# EasyEDA Pro project compute-module-v101.eprj, schematic adc-frontend-dif
Board Name: mod-dif-adc-frontend; Create Date: 2025-09-19; Page Name: P1; Project Name: compute-module-v101; Schematic Name: adc-frontend-dif; Update Date: 2025-12-03; Company: EasyEDA.com; Page Size: A4; Version: V1.0
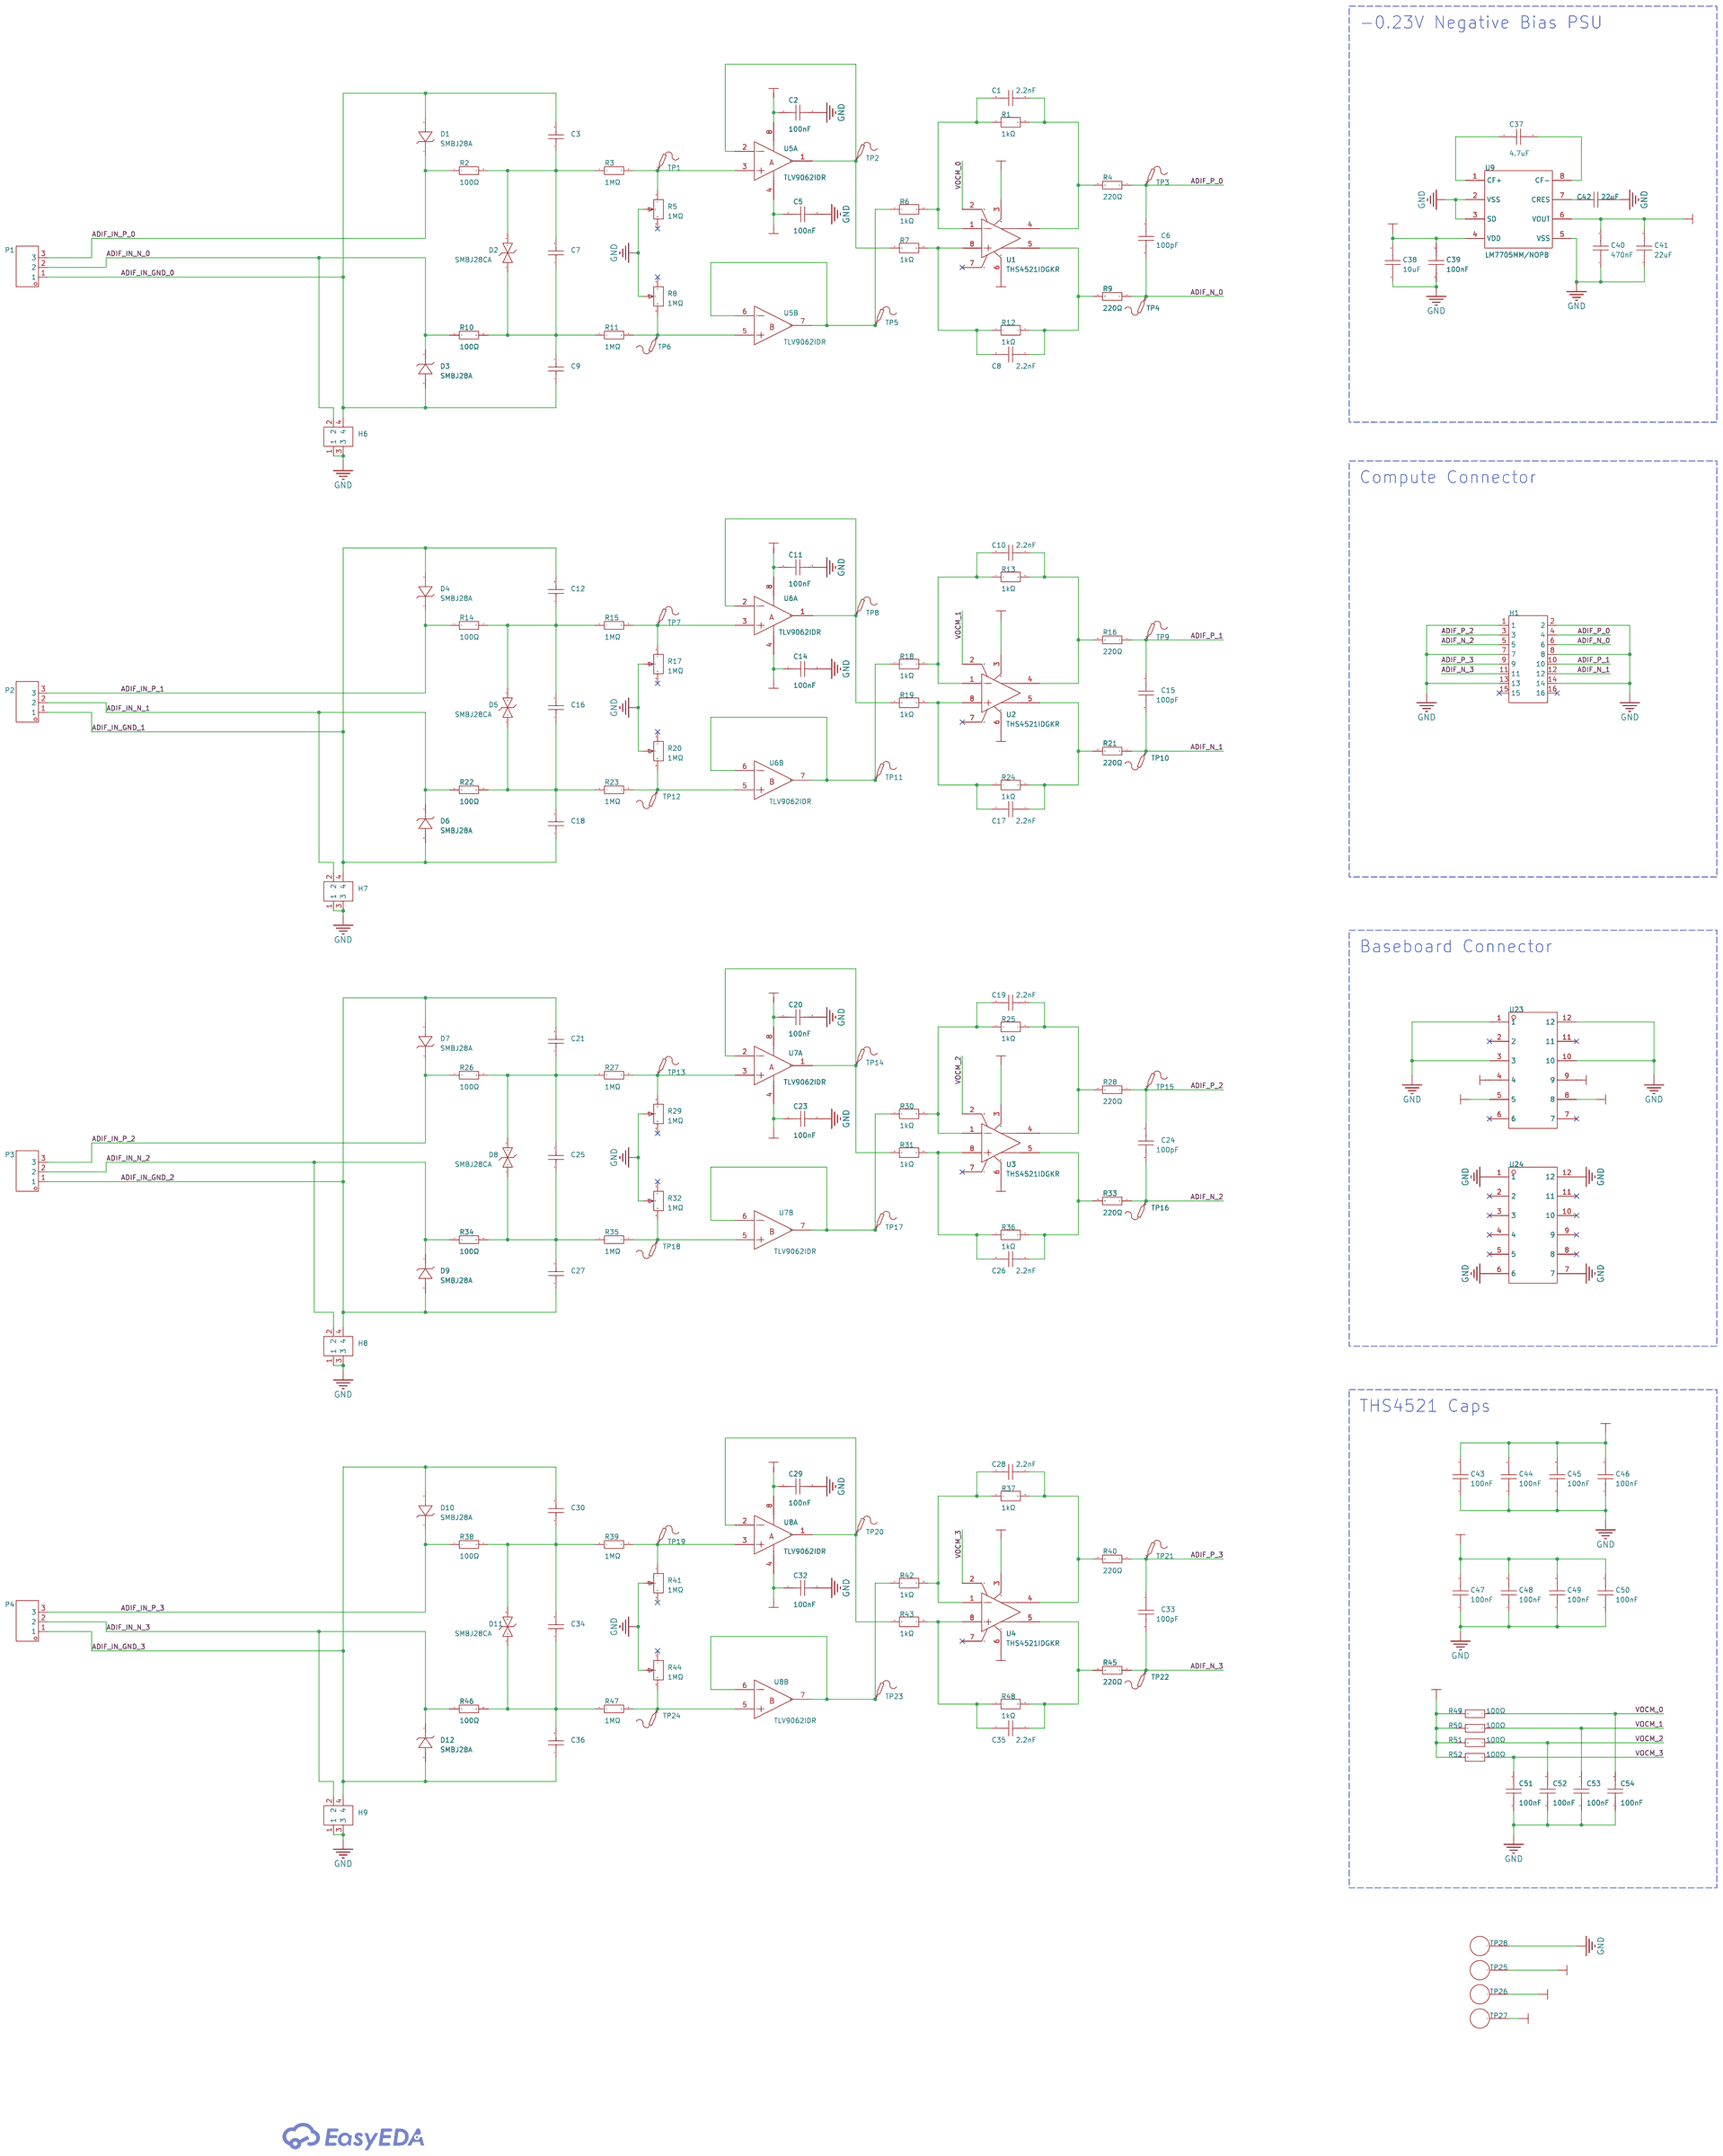
[diagram p2: schematic sheet]

## Parts
C1  2.2nF  [C0603]
C2  100nF  [C0603]
C3  10nF  [C0603]
C5  100nF  [C0603]
C6  100pF  [C0603]
C7  10nF  [C0603]
C8  2.2nF  [C0603]
C9  10nF  [C0603]
C10  2.2nF  [C0603]
C11  100nF  [C0603]
C12  10nF  [C0603]
C14  100nF  [C0603]
C15  100pF  [C0603]
C16  10nF  [C0603]
C17  2.2nF  [C0603]
C18  10nF  [C0603]
C19  2.2nF  [C0603]
C20  100nF  [C0603]
C21  10nF  [C0603]
C23  100nF  [C0603]
C24  100pF  [C0603]
C25  10nF  [C0603]
C26  2.2nF  [C0603]
C27  10nF  [C0603]
C28  2.2nF  [C0603]
C29  100nF  [C0603]
C30  10nF  [C0603]
C32  100nF  [C0603]
C33  100pF  [C0603]
C34  10nF  [C0603]
C35  2.2nF  [C0603]
C36  10nF  [C0603]
C37  4.7uF  [C0603]
C38  10uF  [C0603]
C39  100nF  [C0603]
C40  470nF  [C0603]
C41  22uF  [C0603]
C42  22uF  [C0603]
C43  100nF  [C0603]
C44  100nF  [C0603]
C45  100nF  [C0603]
C46  100nF  [C0603]
C47  100nF  [C0603]
C48  100nF  [C0603]
C49  100nF  [C0603]
C50  100nF  [C0603]
C51  100nF  [C0603]
C52  100nF  [C0603]
C53  100nF  [C0603]
C54  100nF  [C0603]
D1  SMBJ28A  [SMB_L4.6-W3.6-LS5.4-RD]
D2  SMBJ28CA  [SMB_L4.6-W3.6-LS5.3-BI]
D3  SMBJ28A  [SMB_L4.6-W3.6-LS5.4-RD]
D4  SMBJ28A  [SMB_L4.6-W3.6-LS5.4-RD]
D5  SMBJ28CA  [SMB_L4.6-W3.6-LS5.3-BI]
D6  SMBJ28A  [SMB_L4.6-W3.6-LS5.4-RD]
D7  SMBJ28A  [SMB_L4.6-W3.6-LS5.4-RD]
D8  SMBJ28CA  [SMB_L4.6-W3.6-LS5.3-BI]
D9  SMBJ28A  [SMB_L4.6-W3.6-LS5.4-RD]
D10  SMBJ28A  [SMB_L4.6-W3.6-LS5.4-RD]
D11  SMBJ28CA  [SMB_L4.6-W3.6-LS5.3-BI]
D12  SMBJ28A  [SMB_L4.6-W3.6-LS5.4-RD]
H1  XDZ200-2-08-S-2.0-G1  [HDR-SMD_16P-P2.00-V-M-R2-C8-LS6.5]
H6  2.54-2*2P立贴针  [HDR-SMD_4P-P2.54-V-M-R2-C2-LS7.5]
H7  2.54-2*2P立贴针  [HDR-SMD_4P-P2.54-V-M-R2-C2-LS7.5]
H8  2.54-2*2P立贴针  [HDR-SMD_4P-P2.54-V-M-R2-C2-LS7.5]
H9  2.54-2*2P立贴针  [HDR-SMD_4P-P2.54-V-M-R2-C2-LS7.5]
P1  WJ15EDGRC-3.81-3P  [CONN-TH_3P-P3.81_WJ15EDGRC-3.81-3P]
P2  WJ15EDGRC-3.81-3P  [CONN-TH_3P-P3.81_WJ15EDGRC-3.81-3P]
P3  WJ15EDGRC-3.81-3P  [CONN-TH_3P-P3.81_WJ15EDGRC-3.81-3P]
P4  WJ15EDGRC-3.81-3P  [CONN-TH_3P-P3.81_WJ15EDGRC-3.81-3P]
R1  1kΩ  [R0603]
R2  100Ω  [R1206]
R3  1MΩ  [R0603]
R4  220Ω  [R0603]
R5  1MΩ  [RES-ADJ-TH_3296W]
R6  1kΩ  [R0603]
R7  1kΩ  [R0603]
R8  1MΩ  [RES-ADJ-TH_3296W]
R9  220Ω  [R0603]
R10  100Ω  [R1206]
R11  1MΩ  [R0603]
R12  1kΩ  [R0603]
R13  1kΩ  [R0603]
R14  100Ω  [R1206]
R15  1MΩ  [R0603]
R16  220Ω  [R0603]
R17  1MΩ  [RES-ADJ-TH_3296W]
R18  1kΩ  [R0603]
R19  1kΩ  [R0603]
R20  1MΩ  [RES-ADJ-TH_3296W]
R21  220Ω  [R0603]
R22  100Ω  [R1206]
R23  1MΩ  [R0603]
R24  1kΩ  [R0603]
R25  1kΩ  [R0603]
R26  100Ω  [R1206]
R27  1MΩ  [R0603]
R28  220Ω  [R0603]
R29  1MΩ  [RES-ADJ-TH_3296W]
R30  1kΩ  [R0603]
R31  1kΩ  [R0603]
R32  1MΩ  [RES-ADJ-TH_3296W]
R33  220Ω  [R0603]
R34  100Ω  [R1206]
R35  1MΩ  [R0603]
R36  1kΩ  [R0603]
R37  1kΩ  [R0603]
R38  100Ω  [R1206]
R39  1MΩ  [R0603]
R40  220Ω  [R0603]
R41  1MΩ  [RES-ADJ-TH_3296W]
R42  1kΩ  [R0603]
R43  1kΩ  [R0603]
R44  1MΩ  [RES-ADJ-TH_3296W]
R45  220Ω  [R0603]
R46  100Ω  [R1206]
R47  1MΩ  [R0603]
R48  1kΩ  [R0603]
R49  100Ω  [R0603]
R50  100Ω  [R0603]
R51  100Ω  [R0603]
R52  100Ω  [R0603]
TP1  -  [Test-Point-0.5mm]
TP2  -  [Test-Point-0.5mm]
TP3  -  [Test-Point-0.5mm]
TP4  -  [Test-Point-0.5mm]
TP5  -  [Test-Point-0.5mm]
TP6  -  [Test-Point-0.5mm]
TP7  -  [Test-Point-0.5mm]
TP8  -  [Test-Point-0.5mm]
TP9  -  [Test-Point-0.5mm]
TP10  -  [Test-Point-0.5mm]
TP11  -  [Test-Point-0.5mm]
TP12  -  [Test-Point-0.5mm]
TP13  -  [Test-Point-0.5mm]
TP14  -  [Test-Point-0.5mm]
TP15  -  [Test-Point-0.5mm]
TP16  -  [Test-Point-0.5mm]
TP17  -  [Test-Point-0.5mm]
TP18  -  [Test-Point-0.5mm]
TP19  -  [Test-Point-0.5mm]
TP20  -  [Test-Point-0.5mm]
TP21  -  [Test-Point-0.5mm]
TP22  -  [Test-Point-0.5mm]
TP23  -  [Test-Point-0.5mm]
TP24  -  [Test-Point-0.5mm]
TP25  RH-5004  [TESTPOINT_TH_BD2.5-D1.2]
TP26  RH-5004  [TESTPOINT_TH_BD2.5-D1.2]
TP27  RH-5004  [TESTPOINT_TH_BD2.5-D1.2]
TP28  RH-5004  [TESTPOINT_TH_BD2.5-D1.2]
U1  THS4521IDGKR  [VSSOP-8_L3.0-W3.0-P0.65-LS5.0-BL]
U2  THS4521IDGKR  [VSSOP-8_L3.0-W3.0-P0.65-LS5.0-BL]
U3  THS4521IDGKR  [VSSOP-8_L3.0-W3.0-P0.65-LS5.0-BL]
U4  THS4521IDGKR  [VSSOP-8_L3.0-W3.0-P0.65-LS5.0-BL]
U5  TLV9062IDR  [SOIC-8_L5.0-W4.0-P1.27-LS6.0-BL]  (sections 1,2)
U6  TLV9062IDR  [SOIC-8_L5.0-W4.0-P1.27-LS6.0-BL]  (sections 1,2)
U7  TLV9062IDR  [SOIC-8_L5.0-W4.0-P1.27-LS6.0-BL]  (sections 1,2)
U8  TLV9062IDR  [SOIC-8_L5.0-W4.0-P1.27-LS6.0-BL]  (sections 1,2)
U9  LM7705MM/NOPB  [MSOP-8_L3.0-W3.0-P0.65-LS5.0-BL]
U23  -  [ED12BGFBK-CARD]
U24  -  [ED12BGFBK-CARD]

## Library data of the parts
C1 C8 C10 C17 C19 C26 C28 C35 = 0603B222K500NT: Capacitance:2.2nF Tolerance:±10% Tolerance:±10% Voltage Rating:50V Temperature Coefficient:X7R; LCSC Part Name: 2.2nF ±10% 50V; Supplier Part: C1604; Manufacturer: FH(风华); Supplier Footprint: 0603; JLCPCB Part Class: Basic Part; Datasheet: https://item.szlcsc.com/datasheet/0603B222K500NT/1956.html; Supplier: LCSC; Tolerance: ±10%; Voltage Rating: 50V; Temperature Coefficient: X7R
C2 C5 C11 C14 C20 C23 C29 C32 C39 C43-C54 = CC0603KRX7R9BB104: Capacitance:100nF Tolerance:±10% Tolerance:±10% Voltage Rating:50V Temperature Coefficient:X7R; LCSC Part Name: 100nF ±10% 50V; Supplier Part: C14663; Manufacturer: YAGEO(国巨); Supplier Footprint: 0603; JLCPCB Part Class: Basic Part; Datasheet: https://item.szlcsc.com/datasheet/CC0603KRX7R9BB104/15331.html; Supplier: LCSC; Tolerance: ±10%; Voltage Rating: 50V; Temperature Coefficient: X7R
C3 C7 C9 C12 C16 C18 C21 C25 C27 C30 C34 C36 = CC0603KRX7R0BB103: Capacitance:10nF Tolerance:±10% Tolerance:±10% Voltage Rating:100V Temperature Coefficient:X7R; LCSC Part Name: 10nF ±10% 100V; Supplier Part: C107059; Manufacturer: YAGEO(国巨); Supplier Footprint: 0603; JLCPCB Part Class: Extended Part; Datasheet: https://item.szlcsc.com/datasheet/CC0603KRX7R0BB103/108275.html; Supplier: LCSC; Tolerance: ±10%; Voltage Rating: 100V; Temperature Coefficient: X7R
C6 C15 C24 C33 = CL10C101JB8NNNC: Capacitance:100pF Tolerance:±5% Tolerance:±5% Voltage Rating:50V Temperature Coefficient:C0G; LCSC Part Name: 100pF ±5% 50V; Supplier Part: C14858; Manufacturer: SAMSUNG(三星); Supplier Footprint: 0603; JLCPCB Part Class: Basic Part; Datasheet: https://item.szlcsc.com/datasheet/CL10C101JB8NNNC/15530.html; Supplier: LCSC; Tolerance: ±5%; Voltage Rating: 50V; Temperature Coefficient: C0G
C37 = CL10A475KO8NNNC: Capacitance:4.7uF Tolerance:±10% Tolerance:±10% Voltage Rating:16V Temperature Coefficient:X5R; LCSC Part Name: 4.7uF ±10% 16V; Supplier Part: C19666; Manufacturer: SAMSUNG(三星); Supplier Footprint: 0603; JLCPCB Part Class: Basic Part; Datasheet: https://item.szlcsc.com/datasheet/CL10A475KO8NNNC/20375.html; Supplier: LCSC; Tolerance: ±10%; Voltage Rating: 16V; Temperature Coefficient: X5R
C38 = CL10A106KP8NNNC: Capacitance:10uF Tolerance:±10% Tolerance:±10% Voltage Rating:10V Temperature Coefficient:X5R; LCSC Part Name: 10uF ±10% 10V; Supplier Part: C19702; Manufacturer: SAMSUNG(三星); Supplier Footprint: 0603; JLCPCB Part Class: Basic Part; Datasheet: https://item.szlcsc.com/datasheet/CL10A106KP8NNNC/20411.html; Supplier: LCSC; Tolerance: ±10%; Voltage Rating: 10V; Temperature Coefficient: X5R
C40 = CL10B474KA8NNNC: Capacitance:470nF Tolerance:±10% Tolerance:±10% Voltage Rating:25V Temperature Coefficient:X7R; LCSC Part Name: 470nF ±10% 25V; Supplier Part: C1623; Manufacturer: SAMSUNG(三星); Supplier Footprint: 0603; JLCPCB Part Class: Basic Part; Datasheet: https://item.szlcsc.com/datasheet/CL10B474KA8NNNC/1975.html; Supplier: LCSC; Tolerance: ±10%; Voltage Rating: 25V; Temperature Coefficient: X7R
C41 C42 = CL10A226MQ8NRNC: Capacitance:22uF Tolerance:±20% Tolerance:±20% Voltage Rating:6.3V Temperature Coefficient:X5R; LCSC Part Name: 22uF ±20% 6.3V; Supplier Part: C59461; Manufacturer: SAMSUNG(三星); Supplier Footprint: 0603; JLCPCB Part Class: Basic Part; Datasheet: https://item.szlcsc.com/datasheet/CL10A226MQ8NRNC/60514.html; Supplier: LCSC; Tolerance: ±20%; Voltage Rating: 6.3V; Temperature Coefficient: X5R
D1 D3 D4 D6 D7 D9 D10 D12 = SMBJ28A_C19077582: LCSC Part Name: 单向TVS 28V截止 峰值浪涌电流：13.22A@10/1000us; Supplier Part: C19077582; Manufacturer: R+O(宏嘉诚); Supplier Footprint: DO-214AA(SMB); JLCPCB Part Class: Extended Part; Datasheet: https://item.szlcsc.com/datasheet/SMBJ28A/20275667.html; Supplier: LCSC; Polarity: Unidirectional; Reverse Stand-Off Voltage (Vrwm): 28V; Clamping Voltage: 45.4V; Peak Pulse Current (Ipp): 13.22A@10/1000us; Peak Pulse Power Dissipation (Ppp): 600W@10/1000us; Voltage - Breakdown: 34.4V; Reverse Leakage Current (Ir): 5uA; Number of Channels: 1.0; Operating Temperature: -55℃~+150℃; level of protection: IEC 61000-4-2; Type: TVS
D2 D5 D8 D11 = SMBJ28CA_C726872: LCSC Part Name: 双向TVS 28V截止 峰值浪涌电流：13.3A@10/1000us; Supplier Part: C726872; Manufacturer: TWGMC(迪嘉); Supplier Footprint: DO-214AA(SMB); JLCPCB Part Class: Extended Part; Datasheet: https://item.szlcsc.com/datasheet/SMBJ28CA/773977.html; Supplier: LCSC; Polarity: Bidirectional; Reverse Stand-Off Voltage (Vrwm): 28V; Clamping Voltage: 45.4V; Peak Pulse Current (Ipp): 13.3A@10/1000us; Peak Pulse Power Dissipation (Ppp): 600W@10/1000us; Voltage - Breakdown: 34.4V; Reverse Leakage Current (Ir): 1uA; Operating Temperature: -65℃~+150℃; Type: TVS; Junction Capacitance: 390pF
H1 = XDZ200-2-08-S-2.0-G1: LCSC Part Name: 2x8P 间距:2mm 方针 立贴; Supplier Part: C19268811; Manufacturer: XUNDA(讯答); Supplier Footprint: SMD,P=2mm; JLCPCB Part Class: Extended Part; Datasheet: https://item.szlcsc.com/datasheet/XDZ200-2-08-S-2.0-G1/20528703.html; Supplier: LCSC; Pin Structure: 2x8P; Pitch: 2mm; Circluar Pins/Square Pins: Pin Header; Mounting Type: Surface Mount,Vertical; Number of Rows: 2; Number of Pins: 16P; Current Rating: 1.5A; Length of Mating Pin: 4mm; Insulation Height: 2mm; Operating Temperature: -40℃~+105℃; Color: Black
H6-H9 = 2.54-2*2P立贴针: LCSC Part Name: 2x2P 间距:2.54mm 方针 立贴; Supplier Part: C919361; Manufacturer: BOOMELE(博穆精密); Supplier Footprint: SMD,P=2.54mm; JLCPCB Part Class: Extended Part; Datasheet: https://item.szlcsc.com/datasheet/2.54-2*2P%25E7%25AB%258B%25E8%25B4%25B4%25E9%2592%2588/996736.html; Supplier: LCSC; Pin Structure: 2x2P; Pitch: 2.54mm; Row Spacing: 2.54mm; Circluar Pins/Square Pins: Policy; Mounting Type: Vertical welding; Number of Rows: Double Row; Number of Pins: 4P; Current Rating: 3A; Length of Mating Pin: 6mm; Insulation Height: 2.5mm; Color: Black
P1-P4 = WJ15EDGRC-3.81-3P: LCSC Part Name: 1x3P 3.81mm 排数:1 每排P数:3; Supplier Part: C8406; Manufacturer: KANGNEX(康奈克斯电气); Supplier Footprint: 弯插,P=3.81mm; JLCPCB Part Class: Extended Part; Datasheet: https://item.szlcsc.com/datasheet/WJ15EDGRC-3.81-3P/8900.html; Supplier: LCSC; Connector Type: Board Side/Socket - Closed; Number of Positions or Pins: 1x3P; Pitch: 3.81mm; Mounting Type: Right-Angle Pin; Number of Pins: 3P; Number of Rows: 1; Number of PINs Per Row: 3; Operating Temperature: -40℃~+105℃
R1 R6 R7 R12 R13 R18 R19 R24 R25 R30 R31 R36 R37 R42 R43 R48 = RT0603BRD071KL: Type:Thin Film Resistor Resistance: Tolerance:±0.1% Tolerance:±0.1% Power(Watts): Overload Voltage (Max): Temperature Coefficient:±25ppm/℃ Temperature Coefficient:±25ppm/℃ Operating Temperature Range:-55℃~+155℃ Operating Temperature Range:-55℃~+155℃; LCSC Part Name: 薄膜电阻 1kΩ ±0.1% 100mW; Supplier Part: C110776; Manufacturer: YAGEO(国巨); Supplier Footprint: 0603; JLCPCB Part Class: Extended Part; Datasheet: https://atta.szlcsc.com/upload/public/pdf/source/20170704/1499151282044.pdf; Supplier: LCSC; Type: Thin Film Resistor; Tolerance: ±0.1%; Temperature Coefficient: ±25ppm/℃; Operating Temperature Range: -55℃~+155℃
R2 R10 R14 R22 R26 R34 R38 R46 = CRCW1206100RFKEAHP: Type:Thick Film Resistors Resistance: Tolerance:±1% Tolerance:±1% Power(Watts): Temperature Coefficient:±100ppm/℃ Temperature Coefficient:±100ppm/℃ Operating Temperature:-55℃~+155℃ Operating Temperature:-55℃~+155℃; LCSC Part Name: 厚膜电阻 100Ω ±1% 750mW; Supplier Part: C844642; Manufacturer: VISHAY(威世); Supplier Footprint: 1206; JLCPCB Part Class: Extended Part; Datasheet: https://atta.szlcsc.com/upload/public/pdf/source/20221018/EBA0766182E7785923AA75C06FB4488F.pdf; Supplier: LCSC; Type: Thick Film Resistors; Tolerance: ±1%; Temperature Coefficient: ±100ppm/℃; Operating Temperature: -55℃~+155℃
R3 R11 R15 R23 R27 R35 R39 R47 = TC0325B1004T5F: Type:Thin Film Resistor Resistance:1MΩ Tolerance:±0.1% Tolerance:±0.1% Power(Watts):0.1W Voltage-Supply(Max):75V Temperature Coefficient:±25ppm/℃ Temperature Coefficient:±25ppm/℃; LCSC Part Name: 1MΩ ±0.1% 100mW 薄膜电阻; Supplier Part: C2989464; Manufacturer: UNI-ROYAL(厚声); Supplier Footprint: 0603; JLCPCB Part Class: Extended Part; Datasheet: https://atta.szlcsc.com/upload/public/pdf/source/20220708/6ACD1707201702E70C0F417A19EB926E.pdf; Supplier: LCSC; Type: Thin Film Resistor; Tolerance: ±0.1%; Power(Watts): 0.1W; Voltage-Supply(Max): 75V; Temperature Coefficient: ±25ppm/℃
R4 R9 R16 R21 R28 R33 R40 R45 = 0603WAF2200T5E: Type:Thick Film Resistors Resistance: Tolerance:±1% Tolerance:±1% Power(Watts): Overload Voltage (Max): Temperature Coefficient:±100ppm/℃ Temperature Coefficient:±100ppm/℃ Operating Temperature Range:-55℃~+155℃ Operating Temperature Range:-55℃~+155℃; LCSC Part Name: 220Ω ±1% 100mW 厚膜电阻; Supplier Part: C22962; Manufacturer: UNI-ROYAL(厚声); Supplier Footprint: 0603; JLCPCB Part Class: Basic Part; Datasheet: https://atta.szlcsc.com/upload/public/pdf/source/20200306/C422600_1E6D84923E4A46A82E41ADD87F860B5C.pdf; Supplier: LCSC; Type: Thick Film Resistors; Tolerance: ±1%; Temperature Coefficient: ±100ppm/℃; Operating Temperature Range: -55℃~+155℃
R5 R8 R17 R20 R29 R32 R41 R44 = 3296W-1-105LF: LCSC Part Name: 1MΩ ±10%; Supplier Part: C83687; Manufacturer: BOURNS; Supplier Footprint: SIP-3P,9.5x4.8mm; JLCPCB Part Class: Extended Part; Datasheet: https://item.szlcsc.com/datasheet/3296W-1-105LF/84853.html; Supplier: LCSC; Tolerance: ±10%
R49-R52 = 0603WAF1000T5E: Type:Thick Film Resistors Resistance: Tolerance:±1% Tolerance:±1% Power(Watts): Overload Voltage (Max): Temperature Coefficient:±200ppm/℃ Temperature Coefficient:±200ppm/℃ Operating Temperature Range:-55℃~+155℃ Operating Temperature Range:-55℃~+155℃; LCSC Part Name: 100Ω ±1% 100mW 厚膜电阻; Supplier Part: C22775; Manufacturer: UNI-ROYAL(厚声); Supplier Footprint: 0603; JLCPCB Part Class: Basic Part; Datasheet: https://atta.szlcsc.com/upload/public/pdf/source/20200306/C422600_1E6D84923E4A46A82E41ADD87F860B5C.pdf; Supplier: LCSC; Type: Thick Film Resistors; Tolerance: ±1%; Temperature Coefficient: ±200ppm/℃; Operating Temperature Range: -55℃~+155℃
TP1-TP24 = Test-Point
TP25-TP28 = RH-5004: Connector Type:Pin type (through board) Plastic Color:Yellow Board Space (Diameter φ/ Length x Width):2.5mm; LCSC Part Name: PCB电路板测试点/测试针; Supplier Part: C5199804; Manufacturer: 荣和; JLCPCB Part Class: Extended Part; Supplier: LCSC; Connector Type: Pin type (through board); Plastic Color: Yellow; Board Space (Diameter φ/ Length x Width): 2.5mm
U1-U4 = THS4521IDGKR: LCSC Part Name: 低功耗、负轨输入、轨到轨输出、全差分放大器; Supplier Part: C170157; Manufacturer: TI(德州仪器); Supplier Footprint: MSOP-8; JLCPCB Part Class: Extended Part; Datasheet: https://www.ti.com/cn/lit/gpn/ths4521; Supplier: LCSC; Number of Circuits: Single channel; Current - Input Bias(Ib): 700nA; Voltage - Input Offset(Vos): 240uV; Gain Bandwidth Product(GBP): 95MHz; Slew Rate(SR): 600V/us; -3db Bandwidth: 145MHz; Operating Temperature: -40℃~+85℃; Output Type: Differential
U5-U8 = TLV9062IDR: LCSC Part Name: 适用于成本敏感型系统的10MHz、轨到轨输入输出（RRIO）CMOS运算放大器; Supplier Part: C398355; Manufacturer: TI(德州仪器); Supplier Footprint: SOIC-8; JLCPCB Part Class: Extended Part; Datasheet: https://www.ti.com/cn/lit/gpn/tlv9061; Supplier: LCSC; Number of Channels: 2; Maximum Power Supply Range (Vdd-Vss): 9V; Vos - Input Offset Voltage: 1.6mV; Input Offset Voltage Drift(Vos TC): 0.53uV/℃; Slew Rate: 6.5V/us; Ib - Input Bias Current: 0.5pA; Noise density(eN): 10nV/√Hz@1kHz; Common Mode Rejection Ratio(CMRR): 103dB; Operating Temperature: -40℃~+125℃; Single supply: 1.8V~5.5V
U9 = LM7705MM/NOPB: LCSC Part Name: LM7705低噪声负偏置发生器; Supplier Part: C129980; Manufacturer: TI(德州仪器); Supplier Footprint: MSOP-8; JLCPCB Part Class: Extended Part; Datasheet: https://www.ti.com/cn/lit/gpn/lm7705; Supplier: LCSC
U23 U24 = ED12BGFBK-CARD

## Nets
+3V3: C38.2 C39.2 U9.4(VDD) U23.4 U23.9
-0V23: C5.1 C14.1 C23.1 C32.1 C40.2 C41.2 C47.2 C48.2 C49.2 C50.2 TP27.1 U1.6(VS-) U2.6(VS-) U3.6(VS-) U4.6(VS-) U5.4(VEE/GND) U6.4(VEE/GND) U7.4(VEE/GND) U8.4(VEE/GND) U9.6(VOUT)
GND: C2.2 C5.2 C11.2 C14.2 C20.2 C23.2 C29.2 C32.2 C38.1 C39.1 C40.1 C41.1 C42.1 C43.1 C44.1 C45.1 C46.1 C47.1 C48.1 C49.1 C50.1 C51.1 C52.1 C53.1 C54.1 H1.1 H1.2 H1.7 H1.8 H1.13 H1.14 H6.1 H6.3 H7.1 H7.3 H8.1 H8.3 H9.1 H9.3 R5.2 R8.2 R17.2 R20.2 R29.2 R32.2 R41.2 R44.2 TP28.1 U9.2(VSS) U9.3(SD) U9.5(VSS) U23.1 U23.3 U23.10 U23.12 U24.1 U24.6 U24.7 U24.12
VDDA: C2.1 C11.1 C20.1 C29.1 C43.2 C44.2 C45.2 C46.2 TP25.1 U1.3(VS+) U2.3(VS+) U3.3(VS+) U4.3(VS+) U5.8(VCC) U6.8(VCC) U7.8(VCC) U8.8(VCC) U23.5
ADIF_IN_GND_0: C3.2 C9.1 D1.2(A) D3.2(A) H6.4 P1.1
ADIF_IN_GND_1: C12.2 C18.1 D4.2(A) D6.2(A) H7.4 P2.1
ADIF_IN_GND_2: C21.2 C27.1 D7.2(A) D9.2(A) H8.4 P3.1
ADIF_IN_GND_3: C30.2 C36.1 D10.2(A) D12.2(A) H9.4 P4.1
ADIF_IN_N_0: D3.1(K) H6.2 P1.2 R10.1
ADIF_IN_N_1: D6.1(K) H7.2 P2.2 R22.1
ADIF_IN_N_2: D9.1(K) H8.2 P3.2 R34.1
ADIF_IN_N_3: D12.1(K) H9.2 P4.2 R46.1
ADIF_IN_P_0: D1.1(K) P1.3 R2.1
ADIF_IN_P_1: D4.1(K) P2.3 R14.1
ADIF_IN_P_2: D7.1(K) P3.3 R26.1
ADIF_IN_P_3: D10.1(K) P4.3 R38.1
ADIF_N_0: C6.2 H1.6 R9.1 TP4.1
ADIF_N_1: C15.2 H1.12 R21.1 TP10.1
ADIF_N_2: C24.2 H1.5 R33.1 TP16.1
ADIF_N_3: C33.2 H1.11 R45.1 TP22.1
ADIF_P_0: C6.1 H1.4 R4.1 TP3.1
ADIF_P_1: C15.1 H1.10 R16.1 TP9.1
ADIF_P_2: C24.1 H1.3 R28.1 TP15.1
ADIF_P_3: C33.1 H1.9 R40.1 TP21.1
VOCM: R49.2 R50.2 R51.2 R52.2 TP26.1 U23.8
VOCM_0: C54.2 R49.1 U1.2(VOCM)
VOCM_1: C53.2 R50.1 U2.2(VOCM)
VOCM_2: C52.2 R51.1 U3.2(VOCM)
VOCM_3: C51.2 R52.1 U4.2(VOCM)
$1N1032: C7.1 C9.2 D2.1 R10.2 R11.1
$1N1039: C3.1 C7.2 D2.2 R2.2 R3.1
$1N1359: R7.1 TP2.1 U5.1(OUTA) U5.2(INA-)
$1N1368: R6.1 TP5.1 U5.6(INB-) U5.7(OUTB)
$1N2562: R3.2 R5.1 TP1.1 U5.3(INA+)
$1N4779: C1.2 R1.1 R6.2 U1.1(VIN-)
$1N4819: C8.2 R7.2 R12.1 U1.8(VIN+)
$1N4876: C1.1 R1.2 R4.2 U1.4(VOUT+)
$1N4917: C8.1 R9.2 R12.2 U1.5(VOUT-)
$1N4995: R8.3 R11.2 TP6.1 U5.5(INB+)
$1N11430: C16.1 C18.2 D5.1 R22.2 R23.1
$1N11437: C12.1 C16.2 D5.2 R14.2 R15.1
$1N11444: R19.1 TP8.1 U6.1(OUTA) U6.2(INA-)
$1N11445: R18.1 TP11.1 U6.6(INB-) U6.7(OUTB)
$1N11449: R15.2 R17.1 TP7.1 U6.3(INA+)
$1N11458: C10.2 R13.1 R18.2 U2.1(VIN-)
$1N11459: C17.2 R19.2 R24.1 U2.8(VIN+)
$1N11460: C10.1 R13.2 R16.2 U2.4(VOUT+)
$1N11461: C17.1 R21.2 R24.2 U2.5(VOUT-)
$1N11462: R20.3 R23.2 TP12.1 U6.5(INB+)
$1N12616: C25.1 C27.2 D8.1 R34.2 R35.1
$1N12623: C21.1 C25.2 D8.2 R26.2 R27.1
$1N12630: R31.1 TP14.1 U7.1(OUTA) U7.2(INA-)
$1N12631: R30.1 TP17.1 U7.6(INB-) U7.7(OUTB)
$1N12635: R27.2 R29.1 TP13.1 U7.3(INA+)
$1N12644: C19.2 R25.1 R30.2 U3.1(VIN-)
$1N12645: C26.2 R31.2 R36.1 U3.8(VIN+)
$1N12646: C19.1 R25.2 R28.2 U3.4(VOUT+)
$1N12647: C26.1 R33.2 R36.2 U3.5(VOUT-)
$1N12648: R32.3 R35.2 TP18.1 U7.5(INB+)
$1N13802: C34.1 C36.2 D11.1 R46.2 R47.1
$1N13809: C30.1 C34.2 D11.2 R38.2 R39.1
$1N13816: R43.1 TP20.1 U8.1(OUTA) U8.2(INA-)
$1N13817: R42.1 TP23.1 U8.6(INB-) U8.7(OUTB)
$1N13821: R39.2 R41.1 TP19.1 U8.3(INA+)
$1N13830: C28.2 R37.1 R42.2 U4.1(VIN-)
$1N13831: C35.2 R43.2 R48.1 U4.8(VIN+)
$1N13832: C28.1 R37.2 R40.2 U4.4(VOUT+)
$1N13833: C35.1 R45.2 R48.2 U4.5(VOUT-)
$1N13834: R44.3 R47.2 TP24.1 U8.5(INB+)
$1N22134: C37.1 U9.1(CF+)
$1N22138: C37.2 U9.8(CF-)
$1N22159: C42.2 U9.7(CRES)

Not connected (* = marked no-connect by the designer): H1 15* 16*; R5 3*; R8 1*; R17 3*; R20 1*; R29 3*; R32 1*; R41 3*; R44 1*; U1 7(PD)*; U2 7(PD)*; U3 7(PD)*; U4 7(PD)*; U23 2* 6* 7* 11*; U24 2* 3* 4* 5* 8* 9* 10* 11*

## Notes on the sheet
- -0.23V Negative Bias PSU
- Compute Connector
- Baseboard Connector
- THS4521 Caps
